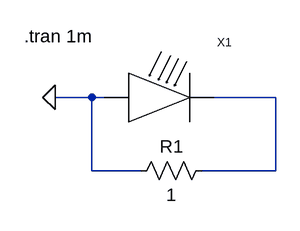
[diagram p0: schematic test.asc]
test.asc, the LTspice schematic file:
Version 4
SHEET 1 880 680
WIRE 112 176 64 176
WIRE 128 176 112 176
WIRE 352 176 272 176
WIRE 112 272 112 176
WIRE 176 272 112 272
WIRE 352 272 352 176
WIRE 352 272 256 272
FLAG 64 176 0
SYMBOL jacModule 192 176 R0
SYMATTR InstName X1
SYMATTR SpiceLine Ifail=2
SYMBOL res 272 256 R90
WINDOW 0 0 56 VBottom 2
WINDOW 3 32 56 VTop 2
SYMATTR InstName R1
SYMATTR Value 1
TEXT 24 96 Left 2 !.tran 1m

The netlist it stands for:
* test.asc
XX1 0 N001 jacModule params: Ifail=2  ; pins modIN modOUT
R1 N001 0 1
.tran 1m
.backanno
.end